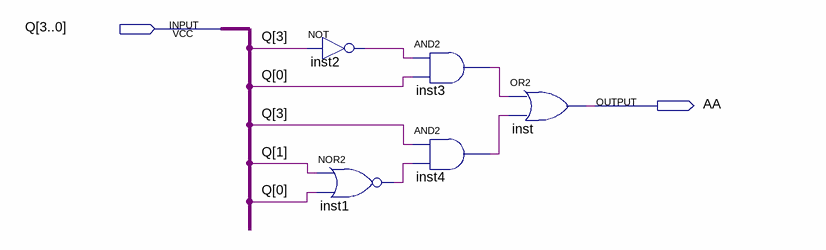
[diagram p0: schematic sheet]
// Quartus schematic AmarilloAbajo.bdf as structural Verilog: 5 symbols, 2 pins
module AmarilloAbajo (
  input  [3:0] Q,
  output AA
);

  wire inst1_out, inst2_out, inst3_out, inst4_out;

  not inst2 (inst2_out, Q[3]);
  nor inst1 (inst1_out, Q[1], Q[0]);
  and inst3 (inst3_out, inst2_out, Q[0]);
  and inst4 (inst4_out, Q[3], inst1_out);
  or inst (AA, inst3_out, inst4_out);
endmodule
